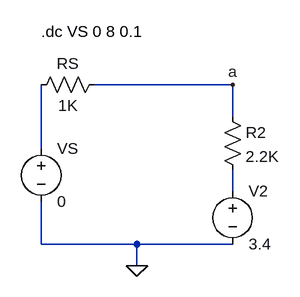
[diagram p0: schematic Circuit2_lab5.asc]
Circuit2_lab5.asc, the LTspice schematic file:
Version 4
SHEET 1 880 680
WIRE 368 48 160 48
WIRE 368 96 368 48
WIRE 80 144 80 48
WIRE 368 208 368 176
WIRE 80 288 80 224
WIRE 224 288 80 288
WIRE 368 288 224 288
WIRE 224 320 224 288
FLAG 224 320 0
FLAG 368 48 a
SYMBOL voltage 80 128 R0
SYMATTR InstName VS
SYMATTR Value 0
SYMBOL voltage 368 192 R0
SYMATTR InstName V2
SYMATTR Value 3.4
SYMBOL res 64 64 R270
WINDOW 0 32 56 VTop 2
WINDOW 3 0 56 VBottom 2
SYMATTR InstName RS
SYMATTR Value 1K
SYMBOL res 352 80 R0
SYMATTR InstName R2
SYMATTR Value 2.2K
TEXT 80 -32 Left 2 !.dc VS 0 8 0.1

The netlist it stands for:
* Circuit2_lab5.asc
VS N001 0 0
V2 N002 0 3.4
RS N001 a 1K
R2 a N002 2.2K
.dc VS 0 8 0.1
.backanno
.end

* Results of the author's LTspice run, read from the files saved beside the schematic
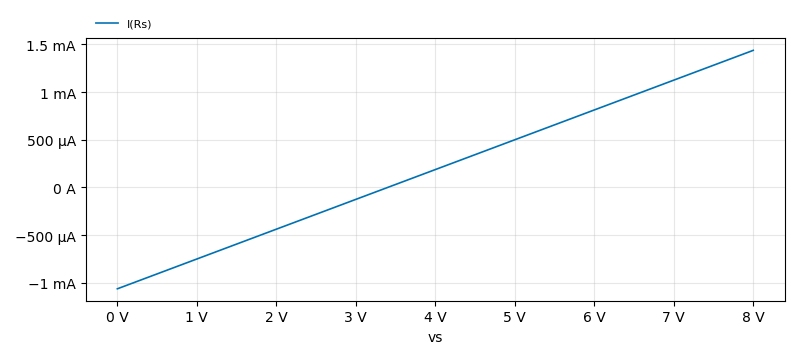
[diagram p1: DC transfer characteristic of Circuit2_lab5.asc, plotted from the saved traces]
* DC transfer characteristic, 1 run:
*   I(Rs): -1.063 mA at vs=0 V, 1.438 mA at vs=8 V, min -1.063 mA, max 1.438 mA